# EAGLE design remote station (EAGLE 8.6.0)
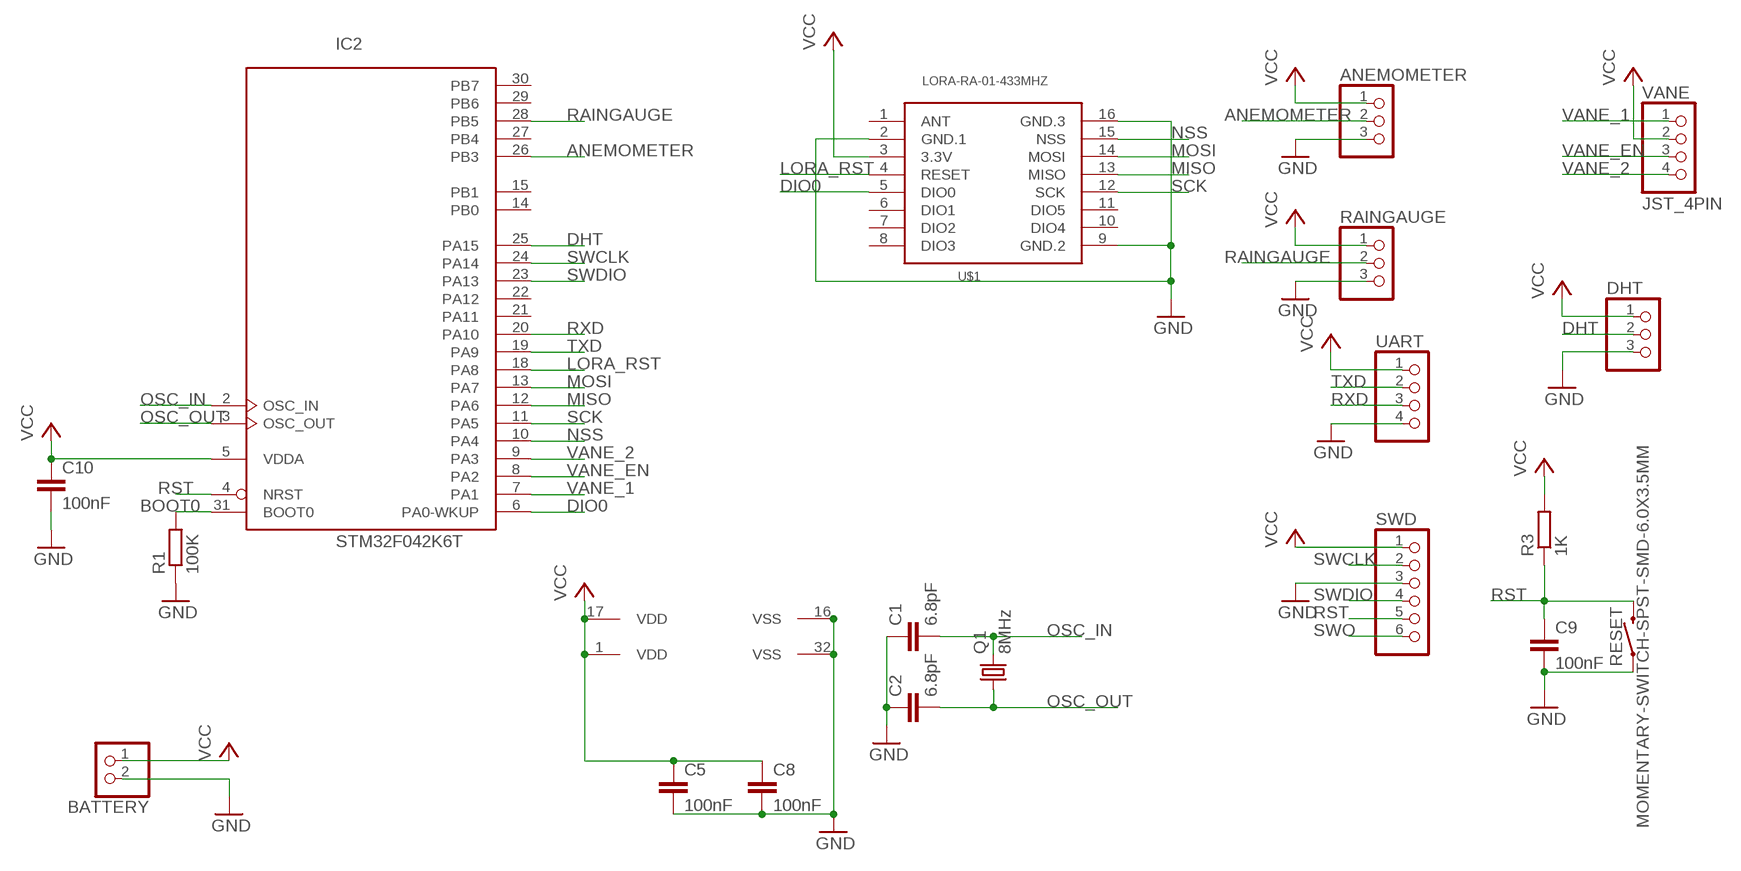
[diagram p0: schematic, sheet 1]

## Parts
ANEMOMETER  JST_3PIN  [JSTPH3]
BATTERY  JST_2PIN-SMT-RA  [JST-PH-2-SMT-RA]
C1  6.8pF  C-EUC0805K  [C0805K]
C2  6.8pF  C-EUC0805K  [C0805K]
C5  100nF  C-EUC0805K  [C0805K]
C8  100nF  C-EUC0805K  [C0805K]
C9  100nF  C-EUC0805K  [C0805K]
C10  100nF  C-EUC0805K  [C0805K]
DHT  JST_3PIN  [JSTPH3]
IC2  STM32F042K6T  [LQFP32]
Q1  8MHz  CRYSTALHC49UP  [HC49UP]
R1  100K  R-EU_R0805W  [R0805W]
R3  1K  R-EU_R0805W  [R0805W]
RAINGAUGE  JST_3PIN  [JSTPH3]
RESET  MOMENTARY-SWITCH-SPST-SMD-6.0X3.5MM  [TACTILE_SWITCH_SMD_6.0X3.5MM]
SWD  PINHD-1X6  [1X06]
U$1  LORA-RA-01-433MHZ  [LORA-RA1-SMD]
UART  PINHD-1X4  [1X04]
VANE  JST_4PIN  [JST-PH-2-SMT-RA]

## Nets
ANEMOMETER: ANEMOMETER.2 IC2.26(PB3)
BOOT0: IC2.31(BOOT0) R1.2
DHT: DHT.2 IC2.25(PA15)
DIO0: IC2.6(PA0-WKUP) U$1.5(DIO0)
GND: ANEMOMETER.3 BATTERY.2 C1.1 C2.1 C5.2 C8.2 C9.2 C10.2 DHT.3 IC2.16(VSS) IC2.32(VSS) R1.1 RAINGAUGE.3 RESET.1 SWD.3 U$1.2(GND.1) U$1.9(GND.2) U$1.16(GND.3) UART.4
LORA_RST: IC2.18(PA8) U$1.4(RESET)
MISO: IC2.12(PA6) U$1.13(MISO)
MOSI: IC2.13(PA7) U$1.14(MOSI)
NSS: IC2.10(PA4) U$1.15(NSS)
OSC_IN: C1.2 IC2.2(OSC_IN) Q1.2
OSC_OUT: C2.2 IC2.3(OSC_OUT) Q1.1
RAINGAUGE: IC2.28(PB5) RAINGAUGE.2
RST: C9.1 IC2.4(NRST) R3.1 RESET.2 SWD.5
RXD: IC2.20(PA10) UART.3
SCK: IC2.11(PA5) U$1.12(SCK)
SWCLK: IC2.24(PA14) SWD.2
SWDIO: IC2.23(PA13) SWD.4
SWO: SWD.6
TXD: IC2.19(PA9) UART.2
VANE_1: IC2.7(PA1) VANE.1
VANE_2: IC2.9(PA3) VANE.4
VANE_EN: IC2.8(PA2) VANE.3
VCC: ANEMOMETER.1 BATTERY.1 C5.1 C8.1 C10.1 DHT.1 IC2.1(VDD) IC2.5(VDDA) IC2.17(VDD) R3.2 RAINGAUGE.1 SWD.1 U$1.3(3.3V) UART.1 VANE.2
Unconnected: IC2.14(PB0) IC2.15(PB1) IC2.21(PA11) IC2.22(PA12) IC2.27(PB4) IC2.29(PB6) IC2.30(PB7) U$1.1(ANT) U$1.6(DIO1) U$1.7(DIO2) U$1.8(DIO3) U$1.10(DIO4) U$1.11(DIO5)

## Library data of the parts
ANEMOMETER DHT RAINGAUGE = adafruit:JST_3PIN
BATTERY = adafruit:JST_2PIN: JST 2-Pin Connectors of various flavors SMT-RA (S2B-PH-SM4) 4UConnector #17311 SMT (B2B-PH-SM4) THM-RA (S2B-PH) THM (B2B-PH)
C1 C2 C5 C8-C10 = rcl:C-EU: CAPACITOR, European symbol; SPICEPREFIX: C
IC2 = micro-stm_v3:STM32F042K*T: ARM 32-bit Cortex™-M0 CPU 48 MHz maximum frequency 32 Kbytes of Flash memory 4 kbytes of SRAM 26 GPIOs 2.4 to 3.6 V application supply
Q1 = crystal:CRYSTAL: CRYSTAL; OC_FARNELL: unknown; OC_NEWARK: unknown
R1 R3 = rcl:R-EU_: RESISTOR, European symbol; SPICEPREFIX: R
RESET = SparkFun-Switches:MOMENTARY-SWITCH-SPST: Momentary Switch (Pushbutton) - SPST Normally-open (NO) SPST momentary switches (buttons, pushbuttons). Variants PTH-12MM - 12mm square, through-hole Momentary Pushbutton Switch - 12mm Square <https://www.sparkfun.com/products/9190> (COM-09190) PTH-6.0MM, PTH-6.0MM-KIT - 6.0mm square, through-hole Mini Pushbutton Switch <https://www.sparkfun.com/products/97> (COM-00097) KIT package intended for soldering kit's - only one side of pads' copper is exposed. PTH-RIGHT-ANGLE-KIT - Right-angle, through-hole Right Angle Tactile Button <https://www.sparkfun.com/products/10791> - Used on SparkFun BigTime Watch Kit <https://www.sparkfun.com/products/11734> SMD-12MM - 12mm square, surface-mount Tactile Button - SMD (12mm) <https://www.sparkfun.com/products/12993> (COM-12993) Used on SparkFun PicoBoard <https://www.sparkfun.com/products/11888> SMD-4.5MM - 4.5mm Square Trackball Switch Used on SparkFun Blackberry Trackballer Breakout <https://www.sparkfun.com/products/13169> SMD-4.6MMX2.8MM - 4.60mm x 2.80mm, surface mount Used on SparkFun SAMD21 Mini Breakout <https://www.sparkfun.com/products/13664> SMD-5.2MM, SMD-5.2-REDUNDANT - 5.2mm square, surface-mount Mini Pushbutton Switch - SMD <https://www.sparkfun.com/products/8720> (COM-08720) Used on Arduino Pro Mini <https://www.sparkfun.com/products/11114> REDUNDANT package connects both switch circuits together SMD-6.0X3.5MM - 6.0 x 3.5mm, surface mount Momentary Reset Switch SMD <https://www.sparkfun.com/products/8229> (COM-08229) SMD-6.2MM-TALL - 6.2mm square, surface mount Tactile Button - SMD (6mm) <https://www.sparkfun.com/products/12992> Used on SparkFun Digital Sandbox <https://www.sparkfun.com/products/12651> SMD-RIGHT-ANGLE - Right-angle, surface mount Used on SparkFun Block for Intel® Edison - Arduino <https://www.sparkfun.com/products/13036>; PROD_ID: SWCH-00815; SF_SKU: COM-08229
SWD = pinhead:PINHD-1X6: PIN HEADER
U$1 = LikeCircuit:LORA-RA-01-433MHZ: 433 MHz Lora Ra-01 Radio Transceiver Module based on SX1278 chip. Visit our more eagle PCB <https://www.likecircuit.com/>
UART = pinhead:PINHD-1X4: PIN HEADER
VANE = adafruit:JST_4PIN

## Net classes
0 default: width 0.254 mm, drill 1 mm, clearance 0.3 mm

## Board
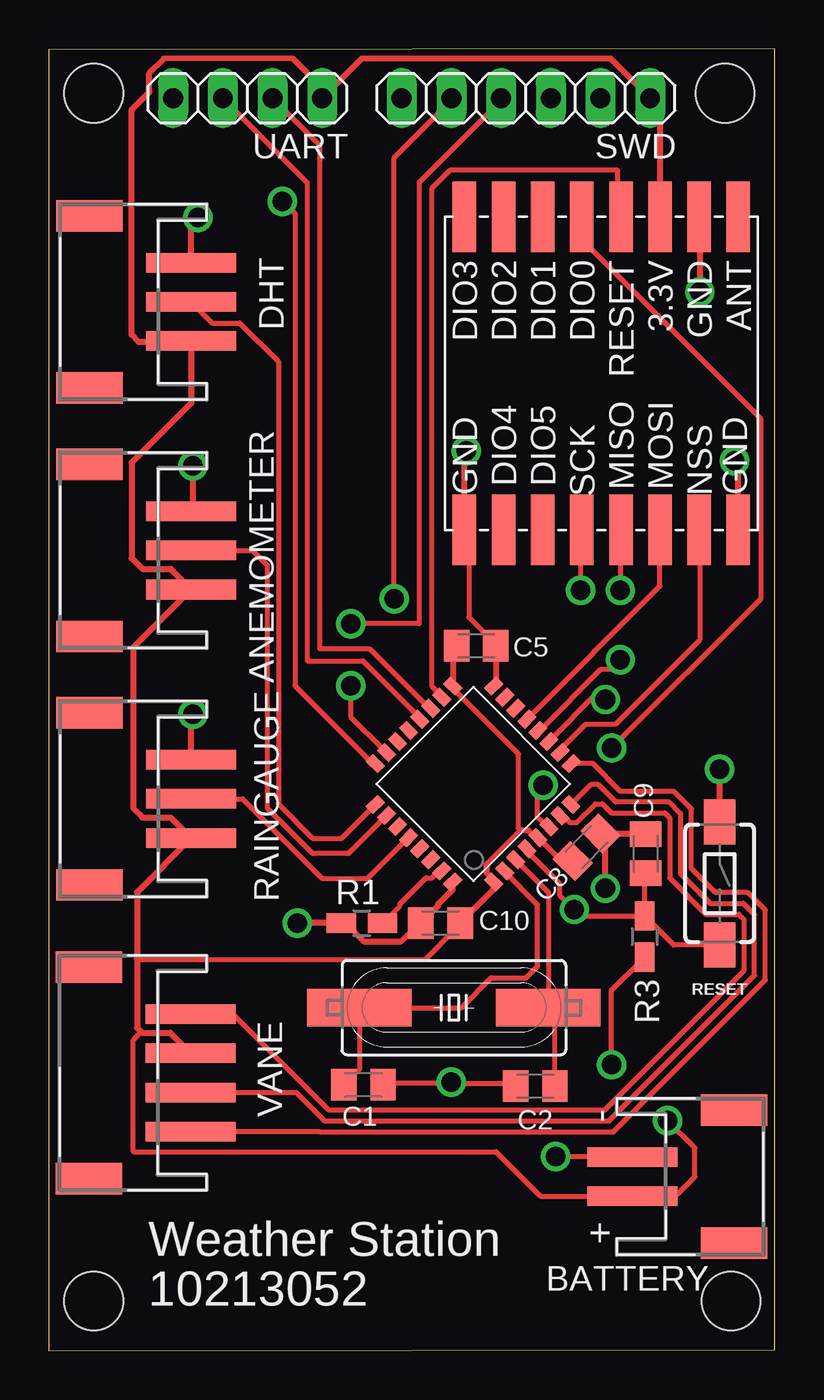
[diagram p1: board, top side]
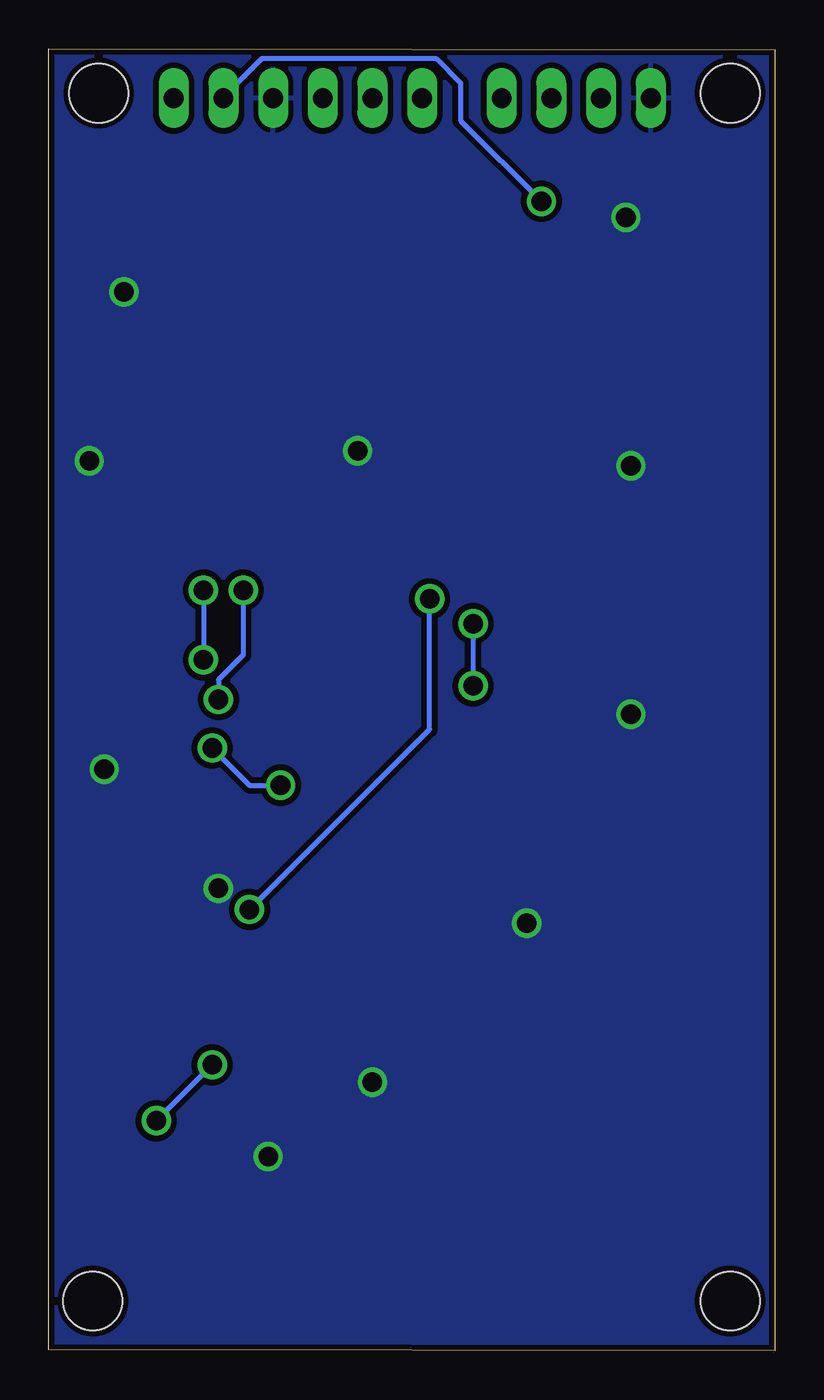
[diagram p2: board, bottom side, seen from below]

Size 37.11 x 66.52 mm. Coordinates in mm from the lower left corner, seen from the top.
Outline: 0,0 37.12,0.05 37.12,66.52 0,66.47 0,0
Copper layers (1*16): Top 0.035mm / dielectric 1.5mm / Bottom 0.035mm
Design rules "default *": minimum track width 10mil, minimum drill 1mm, track to track 0.3mm, track to pad 0.3mm, pad to pad 0.3mm, via to via 0.3mm, smd to smd 0.3mm, copper to edge 0.3mm, drill to drill 0.3mm, minimum pad ring 10mil, minimum via ring 8mil, stop-mask expansion 4mil, vias tented up to drill 0mil, thermal gap 10mil
Holes 3 mm at 2.29,2.54 2.29,64.26 34.57,64.26 34.87,2.54

### Footprints (pad centres in the part's own frame; a part is rotated, then mirrored left to right if it is on the bottom)
JSTPH3 = smd 1 x 4.6: 1 -2,-2.7; 2 0,-2.7; 3 2,-2.7 | smd 1.6 x 3.4: NC1 -4.4,2.5; NC2 4.4,2.5
JST-PH-2-SMT-RA = smd 1 x 4.6: 1 1,-3.7; 2 -1,-3.7 | smd 1.6 x 3.4: NC1 -3.4,1.5; NC2 3.4,1.5
C0805K = smd 1.3 x 1.6: 1 -1,0; 2 1,0
LQFP32 = smd 0.54 x 0.85: 1 -2.8,-4.275; 2 -2,-4.275; 3 -1.2,-4.275; 4 -0.4,-4.275; 5 0.4,-4.275; 6 1.19,-4.275; 7 1.99,-4.275; 8 2.79,-4.275; 17 2.8,4.275; 18 2,4.275; 19 1.2,4.275; 20 0.4,4.275; 21 -0.4,4.275; 22 -1.2,4.275; 23 -2,4.275; 24 -2.8,4.275 | smd 0.85 x 0.54: 9 4.275,-2.8; 10 4.275,-2; 11 4.275,-1.2; 12 4.275,-0.4; 13 4.275,0.4; 14 4.275,1.2; 15 4.275,2; 16 4.275,2.8; 25 -4.275,2.8; 26 -4.275,2; 27 -4.275,1.2; 28 -4.275,0.4; 29 -4.275,-0.4; 30 -4.275,-1.2; 31 -4.275,-2; 32 -4.275,-2.8
HC49UP = smd 5.334 x 1.93: 1 -4.826,0; 2 4.826,0
R0805W = smd 1.5 x 1: 1 -1.052,0; 2 1.052,0
TACTILE_SWITCH_SMD_6.0X3.5MM = smd 2.3 x 1.6: 1 -3.15,0; 2 3.15,0
1X06 = drill 1.016 long: 1 -6.35,0; 2 -3.81,0; 3 -1.27,0; 4 1.27,0; 5 3.81,0; 6 6.35,0
LORA-RA1-SMD = smd 3.6 x 1.2: 1 -8,7; 2 -8,5; 3 -8,3; 4 -8,1; 5 -8,-1; 6 -8,-3; 7 -8,-5; 8 -8,-7; 9 8,-7; 10 8,-5; 11 8,-3; 12 8,-1; 13 8,1; 14 8,3; 15 8,5; 16 8,7
1X04 = drill 1.016 long: 1 -3.81,0; 2 -1.27,0; 3 1.27,0; 4 3.81,0
JST-PH-2-SMT-RA' = smd 1 x 4.6: 1 5,-3.7; 2 3,-3.7; 3 1,-3.7; 4 -1,-3.7 | smd 1.6 x 3.4: NC1 -3.4,1.5; NC2 7.4,1.5

### Placement (x,y rotation side)
ANEMOMETER  4.57,40.89 90 top
BATTERY  33.53,8.89 270 top
C1  16.08,13.59 180 top
C2  24.87,13.51 0 top
C5  21.84,36.02 0 top
C8  27.48,25.73 45 top
C9  30.51,25.4 90 top
C10  20.02,21.84 180 top
DHT  4.57,53.59 90 top
IC2  21.69,28.96 45 top
Q1  20.7,17.53 180 top
R1  16,21.84 0 top
R3  30.45,21.16 270 top
RAINGAUGE  4.57,28.19 90 top
RESET  34.29,23.88 270 top
SWD  24.38,64.01 180 top
U$1  28.24,49.94 270 top
UART  10.16,64.01 180 top
VANE  JST_4PIN  [JST-PH-2-SMT-RA']  3.56,12.19 90 top

### Tracks (layer width: path | path; a pad name or v marks a point on that pad's centre or on a via)
ANEMOMETER
  Top 0.254: IC2.26 15.31,25.4 13.48,25.4 11.18,27.71 11.18,40.13 10.41,40.89 ANEMOMETER.2
BOOT0
  Top 0.254: R1.2 17.94,22.73 17.94,22.82 19.28,24.17 19.59,24.17 19.94,24.52 IC2.31
DHT
  Top 0.254: DHT.2 8.34,52.52 9.75,52.52 11.73,50.54 11.73,27.94 13.48,26.18 14.96,26.18 IC2.25
DIO0  (via drill 1)
  Top 0.254: v25.27,28.89 24.96,28.57 24.96,27.3 25.27,26.99 IC2.6 | v28.77,30.8 36.39,38.42 36.39,47.62 27.5,56.52 27.5,57.79 U$1.5
  Bottom 0.254: v25.27,28.89 26.86,28.89 v28.77,30.8
GND  (via drill 1)
  Top 0.254: 30.47,26.44 C9.2 | C1.1 17.34,13.65 20.51,13.65 v20.57,13.72 20.83,13.65 23.69,13.65 C2.1 | C5.2 22.73,36.2 21.46,37.47 21.46,41.91 U$1.9 | BATTERY.2 29.81,9.91 v25.91,9.91
  Top 0.305: RESET.1 v34.29,29.72 | C8.2 28.45,26.44 | 28.45,26.44 30.47,26.44 | U$1.2 33.27,57.9 v33.27,54.1 | U$1.16 35.24,45.28 v35.05,45.47 | U$1.9 21.24,45.88 v21.34,45.97 | RAINGAUGE.3 7.27,32.42 v7.37,32.51 | ANEMOMETER.3 7.37,42.99 v7.37,45.21 | DHT.3 7.27,57.56 v7.62,57.91 | C5.2 22.84,34.07 IC2.16 | IC2.32 20.65,23.57 19.91,22.83 19.91,22.74 C10.2 18.94,21.84 17.99,20.89 16.12,20.89 15.16,21.84 R1.1 v12.7,21.84 | v28.45,23.62 28.45,26.44
  pour Bottom: 0,66.29 0,0.25 36.88,0.03 37.08,66.37
LORA_RST
  Top 0.254: IC2.18 19.88,33.66 19.56,33.97 19.56,59.37 20.51,60.33 29.08,60.33 29.08,58.1 U$1.4
MISO  (via drill 1)
  Top 0.254: v29.21,38.86 29.21,41.91 U$1.13 | IC2.12 25.15,31.75 28.19,34.8 29.21,34.8 v29.21,35.31
  Bottom 0.254: v29.21,38.86 v29.21,35.31
MOSI
  Top 0.254: IC2.13 31.24,39.07 U$1.14
NSS
  Top 0.254: IC2.10 26.16,30.73 27.43,32 28.96,32 33.27,36.32 33.27,41.91 U$1.15
OSC_IN
  Top 0.254: 23.3,24.37 IC2.2 23.3,24.45 24.97,22.78 24.97,19.64 24.38,19.05 22.61,19.05 21.08,17.53 Q1.2 15.88,14.39 C1.2
OSC_OUT
  Top 0.254: IC2.3 25.53,23.42 Q1.1 25.87,17.19 C2.2
RAINGAUGE
  Top 0.254: RAINGAUGE.2 9.91,28.19 13.97,24.13 16.3,24.13 IC2.28
RST  (via drill 1)
  Top 0.254: RESET.2 31.94,20.73 R3.1 | R3.1 30.45,24.35 C9.1 | v17.65,38.42 17.65,60.96 20.51,63.82 SWD.5 | v26.86,22.54 26.11,23.3 26.11,23.87 24.43,25.54 | 26.98,22.42 v26.86,22.54 | v26.86,22.54 27.19,22.21 R3.1
  Top 0.305: IC2.4 24.43,25.54 | 30.25,22.42 R3.1
  Bottom 0.254: v17.65,38.42 17.65,31.75 v26.86,22.54
RXD
  Top 0.254: UART.3 13.21,59.69 13.21,35.24 16.07,35.24 18.92,32.38 IC2.20
SCK  (via drill 1)
  Top 0.254: 27.94,33.53 28.19,33.53 v28.45,33.27 27.94,33.53 | v27.18,38.86 27.18,41.91 U$1.12 | 27.94,33.53 25.65,31.24 IC2.11
  Bottom 0.254: v28.45,33.27 28.45,34.29 27.18,35.56 v27.18,38.86
SWCLK  (via drill 1)
  Top 0.254: v11.94,58.74 12.57,58.1 12.57,33.97 16.38,30.16 IC2.24
  Bottom 0.254: v11.94,58.74 16.07,62.87 16.07,64.77 17.34,66.04 26.23,66.04 28.13,64.13 SWD.2
SWDIO  (via drill 1)
  Top 0.254: v15.43,33.97 15.43,32.38 17.02,30.8 IC2.23 | v15.43,37.15 18.92,37.15 18.92,59.69 23.05,63.82 SWD.4
  Bottom 0.254: v15.43,37.15 v15.43,33.97
TXD
  Top 0.254: UART.2 13.84,61.6 13.84,35.88 16.38,35.88 19.24,33.02 IC2.19
VANE_1
  Top 0.254: VANE.1 9.42,17.19 14.33,12.29 28.4,12.29 35.52,19.4 35.52,22.05 35.27,22.3 33.58,22.3 31.73,24.15 31.73,27.23 31.48,27.48 28.75,27.48 28.29,27.94 27.93,27.94 26.97,26.99 26.62,26.99 26.27,27.34 IC2.7
VANE_2
  Top 0.254: VANE.4 13.85,11.19 13.87,11.18 28.86,11.18 36.62,18.94 36.62,22.51 35.73,23.41 34.07,23.41 32.84,24.64 32.84,27.69 31.94,28.59 29.21,28.59 27.8,30 IC2.9
VANE_EN
  Top 0.254: VANE.3 12.64,13.19 14.1,11.73 28.63,11.73 36.07,19.17 36.07,22.28 35.5,22.86 33.81,22.86 32.29,24.38 32.29,27.46 31.71,28.03 28.98,28.03 28.06,28.96 27.74,28.96 IC2.8
VCC  (via drill 1)
  Top 0.254: 26.44,24.77 C8.1 26.19,25.02 IC2.5 | v28.77,14.61 28.77,18.41 30.35,20 R3.2 | v31.62,11.75 33.02,10.35 33.02,8.89 32.02,7.89 BATTERY.1 25.13,7.89 22.86,10.16 4.32,10.16 4.32,15.88 4.73,16.28 | IC2.17 20.83,33.66 24,30.48 24,26.67 24.11,26.57 | 4.5,20 19.24,20 20.83,21.59 C10.1
  Top 0.305: U$1.3 31.24,63.5 SWD.1 28.7,66.04 16,66.04 UART.1 | UART.1 13.97,64.51 | VANE.2 6.21,16.24 4.77,16.24 4.73,16.28 4.5,16.51 4.5,20 4.5,23.43 RAINGAUGE.1 6.22,27.24 4.79,27.24 4.32,27.71 4.32,35.94 ANEMOMETER.1 6.22,39.94 4.79,39.94 4.22,40.5 4.22,45.37 7.27,48.42 DHT.1 7.24,51.56 4.57,51.56 4.22,51.91 4.22,63.41 5.14,64.32 5.14,65.27 5.89,66.03 12.45,66.04 13.97,64.51 | C5.1 20.65,35.82 IC2.17 | C10.1 22.73,23.56 IC2.1 22.73,24.06 22.36,24.44 22.36,24.82 24.11,26.57 24.13,26.59 24.51,26.59 24.89,26.22 IC2.5 | UART.1 13.97,64.51
  Bottom 0.254: v31.62,11.75 v28.77,14.61

### Text on the board
tNames: Weather Station | 10213052